# EAGLE design Nano ELRS 2.4GHz RX (EAGLE 9.6.2)
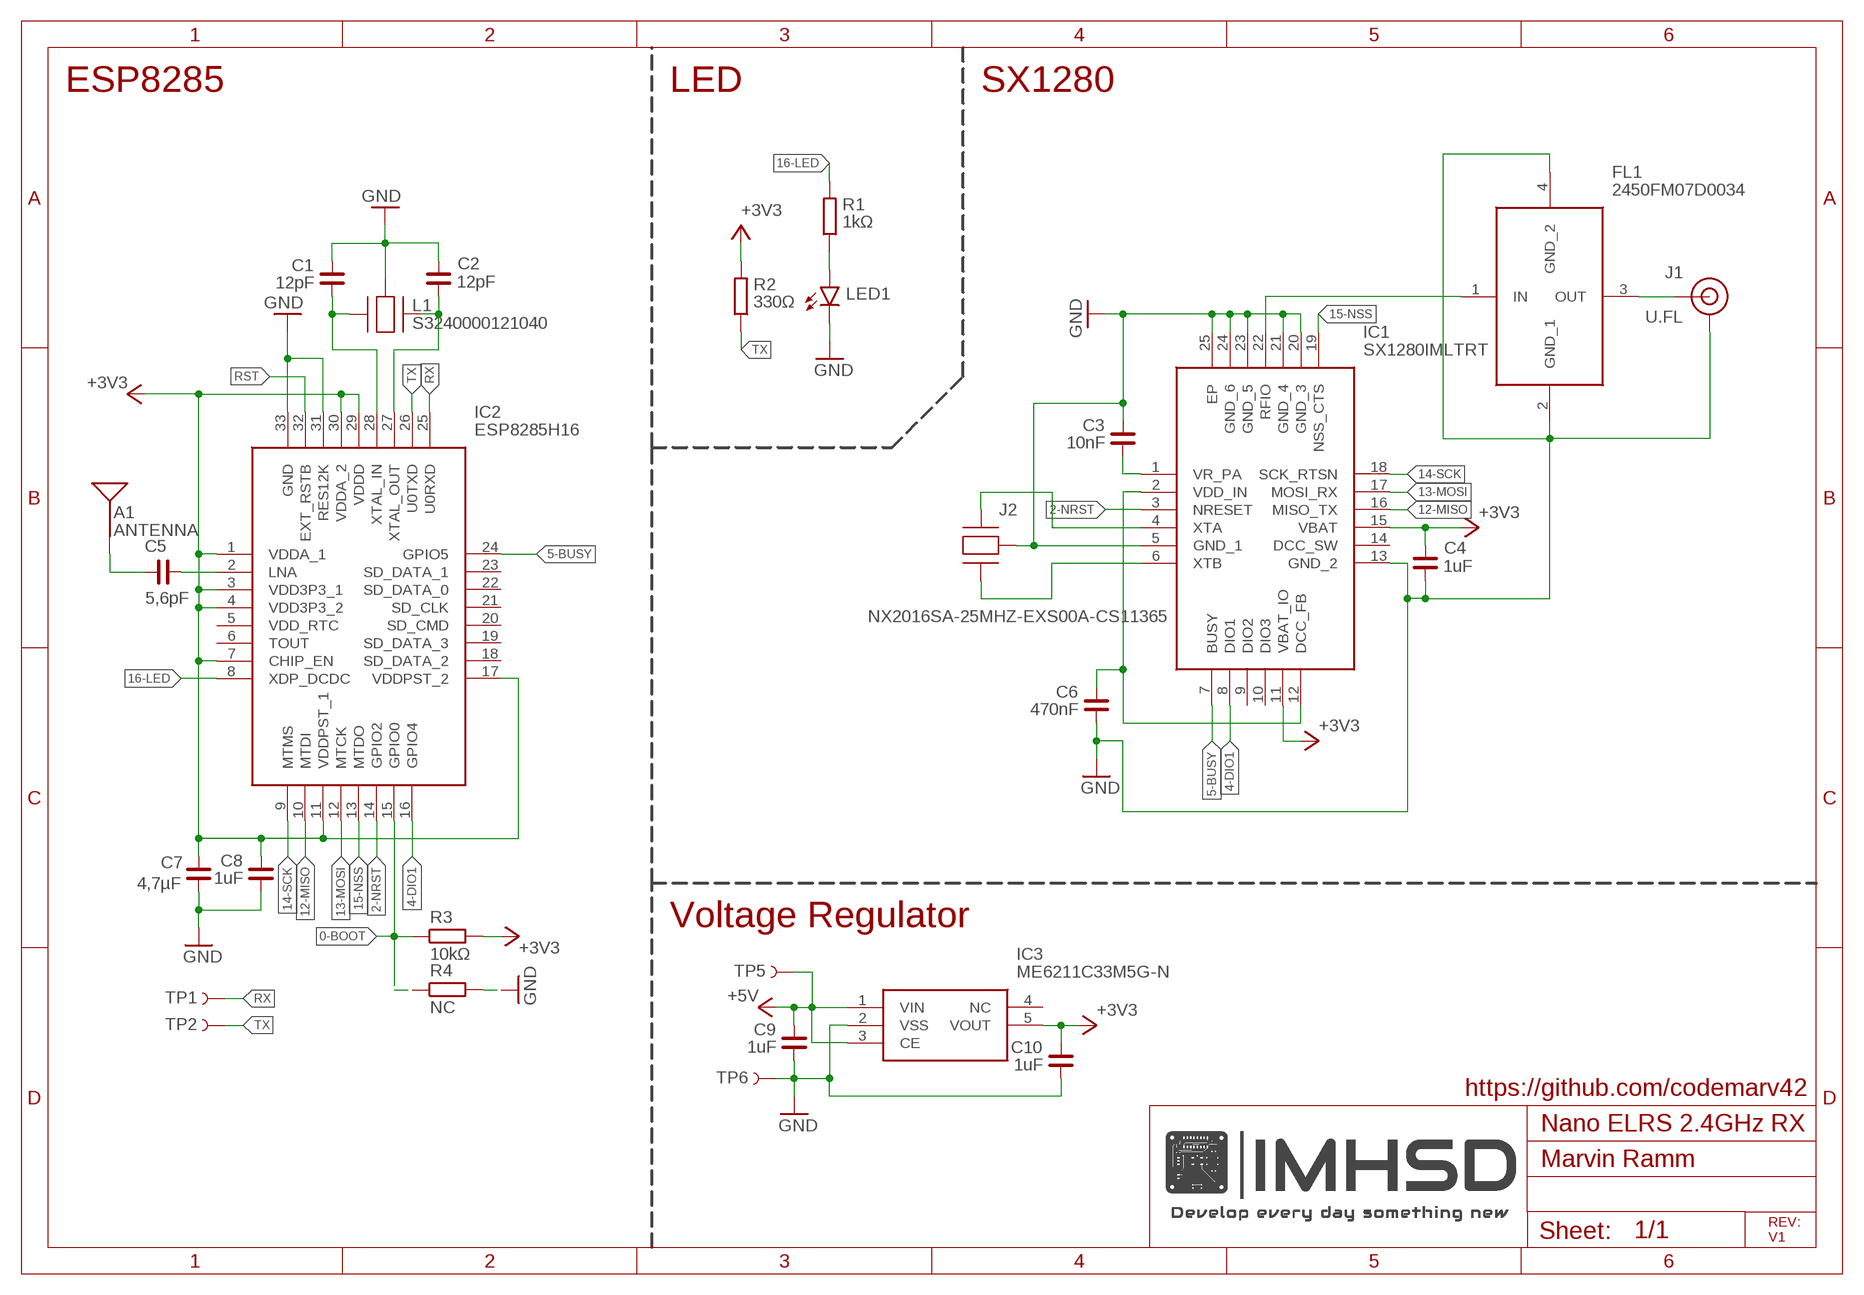
[diagram p0: schematic, sheet 1]

## Parts
A1  ANTENNA  [TRACE_ANTENNA_2.4GHZ_NANO]
C1  12pF  C_0402  [C0402]
C2  12pF  C_0402  [C0402]
C3  10nF  C_0402  [C0402]
C4  1uF  C_0402  [C0402]
C5  5,6pF  C_0402  [C0402]
C6  470nF  C_0402  [C0402]
C7  4,7µF  C_0603  [C0603]
C8  1uF  C_0402  [C0402]
C9  1uF  C_0402  [C0402]
C10  1uF  C_0402  [C0402]
FL1  2450FM07D0034  [2450FM07D0034]
IC1  SX1280IMLTRT  [QFN50P400X400X100-25N]
IC2  ESP8285H16  [QFN50P500X500X90-33N]
IC3  ME6211C33M5G-N  [SOT95P270X145-5N]
J1  U.FL  U.FL2PIN  [U.FL]
J2  NX2016SA-25MHZ-EXS00A-CS11365  [NX2016SA25MHZEXS00ACS11365]
L1  SMD-3225_4P16MHZ_20PF_10PPM_-4  [SMD3225_4P16MHZ20PF10PPM4085]
LED1  SZYY0603W  LEDCHIP-LED0603  [CHIP-LED0603]
R1  1kΩ  R_0402  [R0402]
R2  330Ω  R_0402  [R0402]
R3  10kΩ  R_0402  [R0402]
R4  NC  R_0402  [R0402]
TP1  TEST-POINT3X5  [PAD.03X.05]
TP2  TEST-POINT3X5  [PAD.03X.05]
TP5  TEST-POINT3X5  [PAD.03X.05]
TP6  TEST-POINT3X5  [PAD.03X.05]

## Nets
0-BOOT: IC2.15(GPIO0) R3.2 R4.2
2-NRST: IC1.3(NRESET) IC2.14(GPIO2)
4-DIO1: IC1.8(DIO1) IC2.16(GPIO4)
5-BUSY: IC1.7(BUSY) IC2.24(GPIO5)
12-MISO: IC1.16(MISO_TX) IC2.10(MTDI)
13-MOSI: IC1.17(MOSI_RX) IC2.12(MTCK)
14-SCK: IC1.18(SCK_RTSN) IC2.9(MTMS)
15-NSS: IC1.19(NSS_CTS) IC2.13(MTDO)
16-LED: IC2.8(XDP_DCDC) R1.1
+3V3: C4.1 C7.1 C8.1 C10.1 IC1.11(VBAT_IO) IC1.15(VBAT) IC2.1(VDDA_1) IC2.3(VDD3P3_1) IC2.4(VDD3P3_2) IC2.7(CHIP_EN) IC2.11(VDDPST_1) IC2.17(VDDPST_2) IC2.29(VDDD) IC2.30(VDDA_2) IC3.5(VOUT) R2.1 R3.1
+5V: C9.1 IC3.1(VIN) IC3.3(CE) TP5.1
GND: C1.1 C2.1 C3.1 C4.2 C6.2 C7.2 C8.2 C9.2 C10.2 FL1.2(GND_1) FL1.4(GND_2) IC1.5(GND_1) IC1.13(GND_2) IC1.20(GND_3) IC1.21(GND_4) IC1.23(GND_5) IC1.24(GND_6) IC1.25(EP) IC2.31(RES12K) IC2.33(GND) IC3.2(VSS) J1.1(GND) J1.2(GND) J2.2(GND_2) J2.4(GND_2) L1.2(GND_2) L1.4(GND_2) LED1.C R4.1 TP6.1
N$2: C1.2 IC2.28(XTAL_IN) L1.1(CRYSTAL_1)
N$3: C3.2 IC1.1(VR_PA)
N$4: C2.2 IC2.27(XTAL_OUT) L1.3(CRYSTAL_2)
N$5: C5.1 IC2.2(LNA)
N$6: A1.ANT(SIGNAL) C5.2
N$7: C6.1 IC1.2(VDD_IN) IC1.12(DCC_FB)
N$8: IC1.6(XTB) J2.3(CRYSTAL_2)
N$9: IC1.4(XTA) J2.1(CRYSTAL_1)
N$10: FL1.1(IN) IC1.22(RFIO)
N$11: FL1.3(OUT) J1.FEED(SIGNAL)
N$18: LED1.A R1.2
RST: IC2.32(EXT_RSTB)
RX: IC2.25(U0RXD) TP1.1
TX: IC2.26(U0TXD) R2.2 TP2.1
Unconnected: IC1.9(DIO2) IC1.10(DIO3) IC1.14(DCC_SW) IC2.5(VDD_RTC) IC2.6(TOUT) IC2.18(SD_DATA_2) IC2.19(SD_DATA_3) IC2.20(SD_CMD) IC2.21(SD_CLK) IC2.22(SD_DATA_0) IC2.23(SD_DATA_1) IC3.4(NC)

## Notes on the sheet
- ESP8285 | LED | SX1280
- S3240000121040
- Voltage Regulator
- https://github.com/codemarv42
- Marvin Ramm
- REV:
  V1

## Library data of the parts
A1 = SparkFun-RF:ANTENNA: Single-ended Antennae 2.4GHz and antennae with just one terminal. These are all chip antennae. 2.4GHz (WiFi/BT/ZigBee) Antennae ANT-2.4GHZ-6.5X2.2MM - 6.5 x 2.2 mm chip antenna. (SparkFun Product <https://www.sparkfun.com/products/144>) ANT-2.4GHZ8.0X1.0MM - 8.0 x 1.0 mm chip antenna. (Datasheet <http://www.mouser.com/ds/2/611/antenna_2500at44m0400-242425.pdf>) ANT-2.4GHZ9.5X2.0MM - 9.5 x 2.0 mm chip antenna. (SparkFun Product <https://www.sparkfun.com/products/9025>)
C1-C10 = rc-master-smd:C_: NON-POLARIZED CAP
FL1 = 2450FM07D0034:2450FM07D0034: Miniature 2.45GHz Impedance Matched Front-End Filter Optimized for Semtech SX1280, SX1281 Source: Datasheet; DESCRIPTION: Miniature 2.45GHz Impedance Matched Front-End Filter Optimized for Semtech SX1280, SX1281; HEIGHT: 0.4mm; MANUFACTURER_NAME: JOHANSON TECHNOLOGY; MANUFACTURER_PART_NUMBER: 2450FM07D0034
IC1 = SX1280IMLTRT:SX1280IMLTRT: RF Transceiver Long range 2.4 GHz Wireless Transceiver Source: Datasheet <https://datasheet.datasheetarchive.com/originals/distributors/DKDS-37/728740.pdf>; ARROW_PART_NUMBER: SX1280IMLTRT; ARROW_PRICE-STOCK: https://www.arrow.com/en/products/sx1280imltrt/semtech?region=nac; DESCRIPTION: RF Transceiver Long range 2.4 GHz Wireless Transceiver; HEIGHT: 1mm; MANUFACTURER_NAME: SEMTECH; MANUFACTURER_PART_NUMBER: SX1280IMLTRT; MOUSER_PART_NUMBER: 947-SX1280IMLTRT; MOUSER_PRICE-STOCK: https://www.mouser.co.uk/ProductDetail/Semtech/SX1280IMLTRT?qs=5aG0NVq1C4xuoq8G6ZzdxQ%3D%3D
IC2 = ESP8285H16:ESP8285H16: IC RF TXRX+MCU WIFI 32VFQFN Source: Datasheet <https://componentsearchengine.com/Datasheets/1/ESP8285H16.pdf>; DESCRIPTION: IC RF TXRX+MCU WIFI 32VFQFN; HEIGHT: 0.9mm; MANUFACTURER_NAME: Espressif Systems; MANUFACTURER_PART_NUMBER: ESP8285H16; MOUSER_PART_NUMBER: 356-ESP8285H16; MOUSER_PRICE-STOCK: https://www.mouser.co.uk/ProductDetail/Espressif-Systems/ESP8285H16?qs=Cb2nCFKsA8p%2FOZGxIdZOag%3D%3D
IC3 = ME6211C33M5G-N:ME6211C33M5G-N: Fixed 6V 3.3V 500mA SOT-23-5 Low Dropout Regulators(LDO) RoHS Source: Datasheet <https://datasheet.lcsc.com/szlcsc/1811131510_MICRONE-Nanjing-Micro-One-Elec-ME6211C33M5G-N_C82942.pdf>; DESCRIPTION: Fixed 6V 3.3V 500mA SOT-23-5 Low Dropout Regulators(LDO) RoHS; HEIGHT: 1.45mm; MANUFACTURER_NAME: Microne; MANUFACTURER_PART_NUMBER: ME6211C33M5G-N
J1 = SparkFun-Connectors:U.FL2PIN: SMD Antenna Connector - U.FL 2mm height, 3.0mm x 3.0mm receptacle size. SparkFun Products: SparkFun WiFi Shield - ESP8266 <https://www.sparkfun.com/products/13287> SparkFun ESP8266 Thing <https://www.sparkfun.com/products/13231> SparkFun MiniGen - Pro Mini Signal Generator Shield <https://www.sparkfun.com/products/11420>; PROD_ID: CONN-09193; SF_ID: WRL-09144
J2 = NX2016SA-25MHZ-EXS00A-CS11365:NX2016SA-25MHZ-EXS00A-CS11365: CRYSTAL 25MHZ 6PF SMD Source: Datasheet <https://media.digikey.com/pdf/Data Sheets/NDK PDFs/NX2016SA-25MHz-EXS00A-CS11365.pdf>; DESCRIPTION: CRYSTAL 25MHZ 6PF SMD; HEIGHT: 0.5mm; MANUFACTURER_NAME: NDK; MANUFACTURER_PART_NUMBER: NX2016SA-25MHZ-EXS00A-CS11365
L1 = SMD-3225_4P16MHZ_20PF_10PPM_-4:SMD-3225_4P16MHZ_20PF_10PPM_-4: SMD-3225_4P16MHZ 20PF 10PPM -40~+85 Source: Datasheet <https://datasheet.lcsc.com/szlcsc/Zhejiang-Abel-Elec-SMD-3225-4P-16MHz-20pF-10ppm-40-85_C164049.pdf>; DESCRIPTION: SMD-3225_4P16MHZ 20PF 10PPM -40~+85; HEIGHT: 0.8mm; MANUFACTURER_NAME: TAE(Zhejiang Abel Elec); MANUFACTURER_PART_NUMBER: SMD-3225_4P16MHZ 20PF 10PPM -40~+85℃
LED1 = led:LED: LED OSRAM: - CHIPLED LG R971, LG N971, LY N971, LG Q971, LY Q971, LO R971, LY R971 LH N974, LH R974 LS Q976, LO Q976, LY Q976 LO Q996 - Hyper CHIPLED LW Q18S LB Q993, LB Q99A, LB R99A - SideLED LS A670, LO A670, LY A670, LG A670, LP A670 LB A673, LV A673, LT A673, LW A673 LH A674 LY A675 LS A676, LA A676, LO A676, LY A676, LW A676 LS A679, LY A679, LG A679 - Hyper Micro SIDELED® LS Y876, LA Y876, LO Y876, LY Y876 LT Y87S - SmartLED LW L88C, LW L88S LB L89C, LB L89S, LG L890 LS L89K, LO L89K, LY L89K LS L896, LA L896, LO L896, LY L896 - TOPLED LS T670, LO T670, LY T670, LG T670, LP T670 LSG T670, LSP T670, LSY T670, LOP T670, LYG T670 LG T671, LOG T671, LSG T671 LB T673, LV T673, LT T673, LW T673 LH T674 LS T676, LA T676, LO T676, LY T676, LB T676, LH T676, LSB T676, LW T676 LB T67C, LV T67C, LT T67C, LS T67K, LO T67K, LY T67K, LW E67C LS E67B, LA E67B, LO E67B, LY E67B, LB E67C, LV E67C, LT E67C LW T67C LS T679, LY T679, LG T679 LS T770, LO T770, LY T770, LG T770, LP T770 LB T773, LV T773, LT T773, LW T773 LH T774 LS E675, LA E675, LY E675, LS T675 LS T776, LA T776, LO T776, LY T776, LB T776 LHGB T686 LT T68C, LB T68C - Hyper Mini TOPLED® LB M676 - Mini TOPLED Santana® LG M470 LS M47K, LO M47K, LY M47K Source: http://www.osram.convergy.de LUXEON: - LUMILED® LXK2-PW12-R00, LXK2-PW12-S00, LXK2-PW14-U00, LXK2-PW14-V00 LXK2-PM12-R00, LXK2-PM12-S00, LXK2-PM14-U00 LXK2-PE12-Q00, LXK2-PE12-R00, LXK2-PE12-S00, LXK2-PE14-T00, LXK2-PE14-U00 LXK2-PB12-K00, LXK2-PB12-L00, LXK2-PB12-M00, LXK2-PB14-N00, LXK2-PB14-P00, LXK2-PB14-Q00 LXK2-PR12-L00, LXK2-PR12-M00, LXK2-PR14-Q00, LXK2-PR14-R00 LXK2-PD12-Q00, LXK2-PD12-R00, LXK2-PD12-S00 LXK2-PH12-R00, LXK2-PH12-S00 LXK2-PL12-P00, LXK2-PL12-Q00, LXK2-PL12-R00 Source: www.luxeon.com KINGBRIGHT: KA-3528ASYC Source: www.kingbright.com
R1-R4 = rc-master-smd:R_: RESISTOR
TP1 TP2 TP5 TP6 = SparkFun-Connectors:TEST-POINT: SparkFun Test Points Bare copper test points for troubleshooting or In-Circuit-Testing. These are used by our Production team for verifying production board runs using pogo-pins on test beds. SparkFun Products: SparkFun LSM9DS1 Breakout <https://www.sparkfun.com/products/13284> SparkFun PSOC <https://www.sparkfun.com/products/13714> SparkFun Load Cell Amplifier <https://www.sparkfun.com/products/13879>

## Board
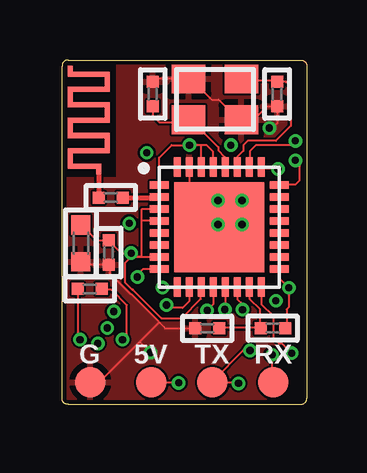
[diagram p1: board, top side]
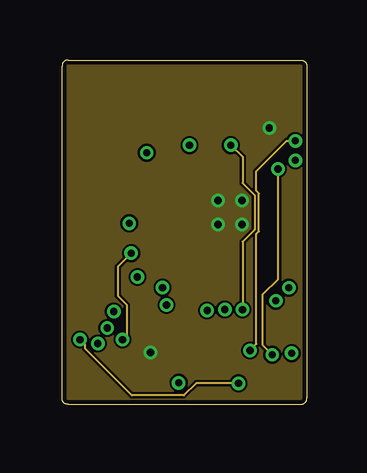
[diagram p2: board, inner layer Route2]
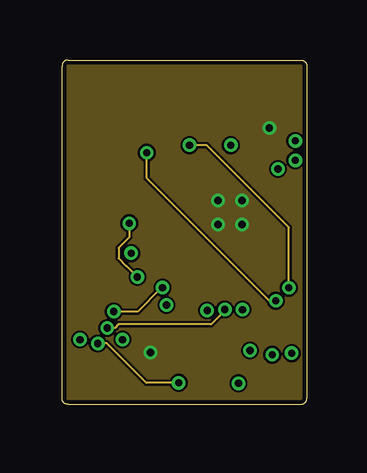
[diagram p3: board, inner layer Route15]
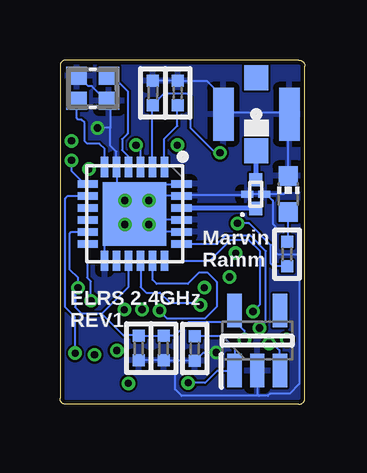
[diagram p4: board, bottom side, seen from below]

Size 10.2 x 14.35 mm. Coordinates in mm from the lower left corner, seen from the top.
Outline: 0.25,0 9.95,0 arc90 10.2,0.25 10.2,14.1 arc90 9.95,14.35 0.25,14.35 arc90 0,14.1 0,0.25 arc90 0.25,0
Copper layers (1+2*15+16): Top 0.035mm / dielectric 0.22mm / Route2 0.035mm / dielectric 0.22mm / Route15 0.035mm / dielectric 0.22mm / Bottom 0.035mm
Design rules "JLCPCB_4-6layer *": minimum track width 0.09mm, minimum drill 0.3mm, track to track 0.09mm, track to pad 0.2mm, pad to pad 7mil, via to via 7mil, smd to smd 7mil, copper to edge 7mil, drill to drill 6mil, minimum pad ring 6mil, minimum via ring 0.13mm, stop-mask expansion 0.1mm, vias tented up to drill 13mil, thermal gap 10mil
tRestrict: area 4,4.8 to 9.2,10
bRestrict: area 5,5.8 to 9.2,10

### Footprints (pad centres in the part's own frame; a part is rotated, then mirrored left to right if it is on the bottom)
TRACE_ANTENNA_2.4GHZ_NANO = smd 0.21 x 0.45: ANT 0.01,-0.125; P$13 -1.18,3.955 | smd 1.75 x 0.21: P$2 -0.41,0.635; P$4 -0.41,1.275; P$6 -0.41,1.915; P$8 -0.41,2.555; P$10 -0.41,3.195; P$12 -0.41,3.835 | smd 0.21 x 0.85: P$3 0.36,0.955; P$5 -1.18,1.595; P$7 0.36,2.235; P$9 -1.18,2.875; P$11 0.36,3.515; P$14 -1.18,0.315 | smd 1.4 x 0.21: P$15 -0.585,-0.005
C0402 = smd 0.5 x 0.5: 1 -0.508,0; 2 0.508,0
C0603 = smd 0.8 x 0.8: 1 -0.762,0; 2 0.762,0
2450FM07D0034 = smd 0.55 x 0.55: 1 -0.6,0; 3 0.6,0 | smd 0.3 x 0.5: 2 0,-0.35; 4 0,0.35
QFN50P400X400X100-25N = smd 0.85 x 0.3: 1 -1.95,1.25; 2 -1.95,0.75; 3 -1.95,0.25; 4 -1.95,-0.25; 5 -1.95,-0.75; 6 -1.95,-1.25; 13 1.95,-1.25; 14 1.95,-0.75; 15 1.95,-0.25; 16 1.95,0.25; 17 1.95,0.75; 18 1.95,1.25 | smd 0.3 x 0.85: 7 -1.25,-1.95; 8 -0.75,-1.95; 9 -0.25,-1.95; 10 0.25,-1.95; 11 0.75,-1.95; 12 1.25,-1.95; 19 1.25,1.95; 20 0.75,1.95; 21 0.25,1.95; 22 -0.25,1.95; 23 -0.75,1.95; 24 -1.25,1.95 | smd 2.65 x 2.65: 25 0,0
QFN50P500X500X90-33N = smd 0.8 x 0.3: 1 -2.5,1.75; 2 -2.5,1.25; 3 -2.5,0.75; 4 -2.5,0.25; 5 -2.5,-0.25; 6 -2.5,-0.75; 7 -2.5,-1.25; 8 -2.5,-1.75; 17 2.5,-1.75; 18 2.5,-1.25; 19 2.5,-0.75; 20 2.5,-0.25; 21 2.5,0.25; 22 2.5,0.75; 23 2.5,1.25; 24 2.5,1.75 | smd 0.3 x 0.8: 9 -1.75,-2.5; 10 -1.25,-2.5; 11 -0.75,-2.5; 12 -0.25,-2.5; 13 0.25,-2.5; 14 0.75,-2.5; 15 1.25,-2.5; 16 1.75,-2.5; 25 1.75,2.5; 26 1.25,2.5; 27 0.75,2.5; 28 0.25,2.5; 29 -0.25,2.5; 30 -0.75,2.5; 31 -1.25,2.5; 32 -1.75,2.5 | smd 3.75 x 3.75: 33 0,0
SOT95P270X145-5N = smd 1.4 x 0.6: 1 -1.25,0.95; 2 -1.25,0; 3 -1.25,-0.95; 4 1.25,-0.95; 5 1.25,0.95
U.FL = smd 2.2 x 0.85: 1 0,1.375; 2 0,-1.375 | smd 1.05 x 1: FEED 1.525,0; NC -1.525,0
NX2016SA25MHZEXS00ACS11365 = smd 0.85 x 0.75: 1 -0.675,-0.525; 2 0.675,-0.525; 3 0.675,0.525; 4 -0.675,0.525
SMD3225_4P16MHZ20PF10PPM4085 = smd 1.4 x 1.2: 1 -1.1,-0.85; 2 1.1,-0.85; 3 1.1,0.85; 4 -1.1,0.85
CHIP-LED0603 = smd 0.8 x 0.8: A 0,-0.75; C 0,0.75
R0402 = smd 0.5 x 0.5: 1 -0.508,0; 2 0.508,0
PAD.03X.05 = smd 1.27 x 1.27: 1 0,0

### Placement (x,y rotation side)
A1  1.51,9.93 0 top
C1  3.78,12.94 270 top
C2  8.96,12.93 90 top
C3  5.29,12.97 270 bottom
C4  6.92,2.35 270 bottom
C5  2.03,8.62 180 top
C6  6.33,12.97 90 bottom
C7  0.79,6.71 270 top
C8  1.94,6.33 270 top
C9  4.58,2.33 270 bottom
C10  5.88,2.34 270 bottom
FL1  2.05,8.76 90 bottom
IC1  7.09,7.93 270 bottom
IC2  6.55,7.39 0 top
IC3  1.98,2.66 90 bottom
J1  2.02,12.09 270 bottom
J2  8.84,13.18 180 bottom
L1  6.37,12.71 0 top
LED1  0.69,8.77 0 bottom
R1  0.73,6.26 90 bottom
R2  1.16,4.82 180 top
R3  8.79,3.18 180 top
R4  6.05,3.17 0 top
TP1  8.8,0.92 0 top
TP2  6.26,0.92 0 top
TP5  3.73,0.92 0 top
TP6  1.19,0.92 0 top

### Tracks (layer width: path | path; a pad name or v marks a point on that pad's centre or on a via)
0-BOOT
  Top 0.09: 8.23,3.19 6.56,3.19 R4.2 | 8.25,3.2 8.19,3.24 8.1,3.24 8.23,3.19 | 8.25,3.2 R3.2 8.23,3.19 | 8.25,3.2 8.25,3.97 7.83,4.39 7.83,4.86 IC2.15
2-NRST  (via drill 0.3)
  Top 0.09: IC2.14 7.3,4.39 7.52,4.17 v7.52,3.95
  Route2 0.09: v7.04,10.8 7.52,10.32 7.52,9.22 8.03,8.72 8.03,7.28 7.52,6.78 v7.52,3.95
  Bottom 0.09: IC1.3 6.84,10.61 v7.04,10.8
4-DIO1  (via drill 0.3)
  Top 0.09: IC2.16 8.31,4.18 8.79,3.69 8.79,2.78 9.03,2.54 9.16,2.54 v9.57,2.13
  Bottom 0.09: v9.57,2.13 9.57,3.64 9.98,4.04 9.98,8.58 9.88,8.69 IC1.8
5-BUSY  (via drill 0.3)
  Top 0.09: v9.72,10.17 9.88,10.01 9.88,9.32 9.72,9.15 9.06,9.15 IC2.24
  Bottom 0.09: v9.72,10.17 9.72,9.72 9.27,9.27 9.09,9.27 IC1.7
12-MISO  (via drill 0.3)
  Top 0.09: IC2.10 5.29,4.29 5.02,4.02 4.47,4.02 v4.35,4.14
  Bottom 0.09: 6.84,5.94 IC1.16 6.84,4.89 6.62,4.66 6.04,4.66 5.61,4.23 4.41,4.23 v4.35,4.14
13-MOSI  (via drill 0.3)
  Top 0.09: IC2.12 6.3,4.17 v6.04,3.92
  Bottom 0.09: IC1.17 6.34,5.19 6.17,5.03 4.88,5.03 4.41,5.49 4.05,5.49 3.67,5.11 3.67,5.09 3.65,5.08 3.65,4.08 4.14,3.6 5.76,3.6 6.03,3.87 v6.04,3.92
14-SCK  (via drill 0.3)
  Top 0.09: IC2.9 4.18,4.89 v4.18,4.87
  Route15 0.09: v2.16,3.87 3.15,3.87 4.13,4.85 v4.18,4.87
  Bottom 0.09: IC1.18 3.96,5.99 3.1,6.84 2.33,6.84 1.86,6.37 1.86,4.17 v2.16,3.87
15-NSS  (via drill 0.3)
  Top 0.09: IC2.13 6.8,3.97 v6.78,3.96
  Route15 0.09: v1.89,3.18 2.19,3.18 2.34,3.33 6.21,3.33 6.76,3.88 6.76,3.95 v6.78,3.96
  Bottom 0.09: IC1.19 3.65,6.68 3.31,7.02 2.26,7.02 1.62,6.38 1.62,3.44 v1.89,3.18
16-LED  (via drill 0.3)
  Top 0.09: IC2.8 3.37,5.64 3.14,5.42 v3.14,5.31
  Route15 0.09: v2.8,7.54 2.8,6.96 2.35,6.52 2.35,6.08 2.66,5.78 2.67,5.78 v3.14,5.31
  Bottom 0.09: v2.8,7.54 2.32,7.54 1.41,6.64 1.41,5.86 1.3,5.75 R1.1
+3V3  (via drill 0.3)
  Top 0.09: C7.1 0.81,7.47 1.44,6.84 1.89,6.84 C8.1 2.46,6.3 v2.88,6.3 2.88,6.17 3.29,6.17 | 3.29,6.17 3.33,6.17 3.33,7.64 | 3.28,6.16 2.89,6.16 2.62,5.89 2.62,5.09 2.92,4.79 2.96,4.79 4.14,3.6 4.99,3.6 5.79,4.4 5.79,4.88 IC2.11 | 3.28,6.16 4.05,6.16 IC2.7 | IC2.4 3.33,7.64 | R3.1 9.36,3.24 9.36,3.96 9.45,4.05 v9.45,4.86 9.05,5.26 IC2.17 | v2.52,2.7 2.7,2.88 2.7,4.14 2.07,4.77 1.71,4.77 R2.1 | 3.29,6.17 3.28,6.16 | IC2.29 6.3,10.53 6.03,10.8 5.8,10.8 | 5.8,10.8 v5.31,10.8 4.57,10.8 4.05,10.29 IC2.1 | IC2.30 5.8,10.8 | IC2.3 3.33,8.14 3.33,7.64
  Route2 0.09: v2.88,6.3 2.33,5.75 2.33,4.52 2.7,4.14 2.7,2.88 v2.52,2.7
  Route15 0.09: v5.31,10.8 6.03,10.8 9.45,7.38 v9.45,4.86
  Bottom 0.09: v2.52,2.7 2.52,3.08 2.87,3.42 | 2.87,3.42 3.14,3.7 IC3.5 | 2.87,3.42 2.88,3.42 4.87,3.42 5.42,2.85 C10.1 C4.1 6.93,2.88 7.56,2.88 8.46,3.78 | IC1.15 7.34,4.89 8.46,3.78 | IC1.11 9.72,7.19 9.8,7.12 9.8,5.62 9.45,5.27 v9.45,4.86 9.57,4.74 9.57,4.05 9.3,3.78 8.46,3.78
+5V  (via drill 0.3)
  Top 0.09: v4.86,0.9 3.78,0.9 TP5.1
  Route15 0.09: v1.49,2.54 v1.5,2.54 1.86,2.54 3.51,0.9 v4.86,0.9
  Bottom 0.09: C9.1 4.57,2.83 3.42,2.83 2.92,2.33 IC3.1 3.65,1.41 4.15,0.9 v4.86,0.9 | v1.49,2.54 1.34,2.54 1.06,2.26 1.06,1.43 IC3.3
GND  (via drill 0.3)
  Top 0.09: IC2.31 5.3,9.2 6,8.5 v6.5,8.5 | 0.92,5.82 C7.2 0.9,5.85 1.89,5.85 C8.2 1.98,5.76 1.98,5.47 2.85,4.61 2.87,4.61 4.05,3.42 | 3.78,13.5 C1.1 3.9,13.56 L1.4 5.37,13.56 6.23,12.7 6.53,12.7 7.34,11.88 | 8.91,12.42 8.55,12.42 8.1,11.97 | 8.91,12.42 C2.1 8.96,11.72 8.76,11.52 v8.64,11.52 | 8.01,11.88 8.1,11.97 | 8.91,12.42 C2.1 | v6.5,7.5 6.57,7.47 IC2.33 | R4.1 4.3,3.17 4.05,3.42 | 4.05,3.42 3.24,2.61 | 3.24,2.61 1.62,0.99 1.26,0.99 TP6.1 | v3.69,2.16 3.24,2.61 | L1.2 7.58,11.97 8.1,11.97
  Bottom 0.09: IC1.25 7.5,7.53 v7.5,7.5 8.35,6.66 IC1.13 | IC1.25 7.09,8.1 v7.5,8.5 7.84,8.85 IC1.5 7.86,9.89 7.86,10.53 8.1,10.78 8.1,11.52 | IC1.20 6.18,7.18 v6.5,7.5 | IC1.21 6.32,7.68 v6.5,7.5 | 6.32,8.69 IC1.23 5.13,8.71 2.44,8.71 FL1.4 FL1.2 | 6.32,8.69 v6.5,8.5 6.57,8.46 IC1.25 | IC1.24 5.17,9.16 5.83,9.16 6.32,8.69 | 8.37,12.69 8.19,12.69 J2.4 | 9.45,13.77 9.49,13.73 | 9.49,13.73 J2.2 | IC1.25 7.02,7.92 6.57,7.47 v6.5,7.5 | 8.1,12.6 J2.4 | 8.1,11.52 v8.64,11.52 | 5.4,1.83 C10.2 5.89,1.84 6.91,1.84 C4.2 | 5.4,1.83 C9.2 4.49,1.91 4.23,2.16 v3.69,2.16 | 5.4,1.83 5.4,0.63 5.13,0.36 1.9,0.36 | 1.9,0.36 1.53,0.36 1.44,0.45 0.63,0.45 0.23,0.85 0.23,6.19 0.29,6.26 1.13,6.26 1.23,6.36 1.23,7.41 1.33,7.52 1.33,8.49 1.6,8.76 FL1.2 | 3.4,12.75 J1.2 | FL1.2 | J1.2 3.33,12.15 0.72,12.15 J1.1 0.72,12.06 0.72,9.54 LED1.C 0.69,8.96 0.89,8.76 FL1.2 | 1.9,0.36 1.98,0.44 IC3.2 1.98,1.35 | FL1.2 | 9.49,13.73 9.02,13.27 8.87,13.27 8.26,12.65 J2.4 | J2.4 8.1,12.59 8.1,11.52 | J1.2 3.4,12.79 4.08,13.48 C3.1 C6.2
  pour Top: 10.2,14.35 0,14.35 0,12.85 0,0 9.7,0 10.2,0
  pour Bottom: 10.2,14.35 0,14.35 0,12.65 0,0 9.7,0 10.2,0
  pour Route2: 10.2,14.35 0,14.35 0,13.05 0,0 7.3,0 10.2,0 10.2,3.8
  pour Route15: 10.2,14.35 0,14.35 0,12.6 0,0 8.65,0 10.2,0 10.2,1.3
N$2
  Top 0.09: C1.2 3.78,12.04 4.06,11.76 5.17,11.76 L1.1 | 5.22,11.88 L1.1 | 6.75,9.9 6.79,9.89 | 6.79,9.89 IC2.28 | L1.1 5.33,11.76 | L1.1 5.38,11.86 6.51,10.72 6.51,10.58 6.79,10.3 6.79,9.89
N$3
  Bottom 0.09: C3.2 5.31,12.42 5.31,11.61 5.85,11.07 5.85,9.9 IC1.1
N$4
  Top 0.09: L1.3 7.47,13.5 8.91,13.5 C2.2 9.31,13.44 9.54,13.28 9.54,11.61 8.91,10.98 7.74,10.98 7.56,10.8 7.56,10.56 7.31,10.31 IC2.27
N$5
  Top 0.21: C5.1 4.03,8.62 IC2.2
N$6
  Top 0.21: A1.ANT C5.2
N$7  (via drill 0.3)
  Route15 0.09: v8.91,4.32 8.64,4.32 3.53,9.43 v3.53,10.48
  Bottom 0.09: IC1.2 6.36,9.89 6.36,12.45 C6.1 6.3,12.51 5.85,12.96 4.93,12.96 4.77,12.8 4.77,11.52 3.73,10.48 v3.53,10.48 | IC1.12 9.06,6.67 9.06,5.29 8.91,5.13 v8.91,4.32
N$8
  Bottom 0.09: 8.37,9.9 IC1.6 8.35,10.65 8.55,10.87 9.06,10.87 9.17,10.97 9.17,11.73 9.3,11.87 9.43,11.87 9.51,11.95 J2.3 9.45,12.6
N$9
  Bottom 0.09: IC1.4 7.38,9.9 7.38,10.37 7.61,10.6 7.61,11.05 7.38,11.29 7.38,13.05 8.1,13.77 J2.1
N$10
  Bottom 0.21: FL1.1 2.08,8.19 IC1.22
N$11
  Bottom 0.21: FL1.3 2.04,10.54 J1.FEED
N$18
  Bottom 0.09: R1.2 0.72,6.84 0.72,8.01 LED1.A
RX  (via drill 0.3)
  Top 0.09: v9,9.81 8.37,9.81 IC2.25 | v8.76,2.07 8.76,0.96 TP1.1
  Route2 0.09: v9,9.81 9,5.22 8.37,4.59 8.37,2.46 v8.76,2.07
TX  (via drill 0.3)
  Top 0.09: v9.72,10.98 9.54,10.8 8.07,10.8 7.83,10.55 7.83,9.9 IC2.26 | v7.83,2.25 7.56,2.25 6.3,0.99 TP2.1 7.31,0.92 v7.35,0.88 | R2.2 0.65,2.81 v0.75,2.7
  Route2 0.09: v9.72,10.98 9.36,10.98 8.1,9.72 8.1,8.9 8.21,8.79 8.21,7.21 8.1,7.1 8.1,2.52 v7.83,2.25 | v0.75,2.7 0.96,2.49 0.96,2.32 2.91,0.38 5.08,0.38 5.58,0.88 v7.35,0.88

### Text on the board
tPlace: G | 5V | TX | RX
bPlace: Marvin / Ramm | ELRS 2.4GHz / REV1